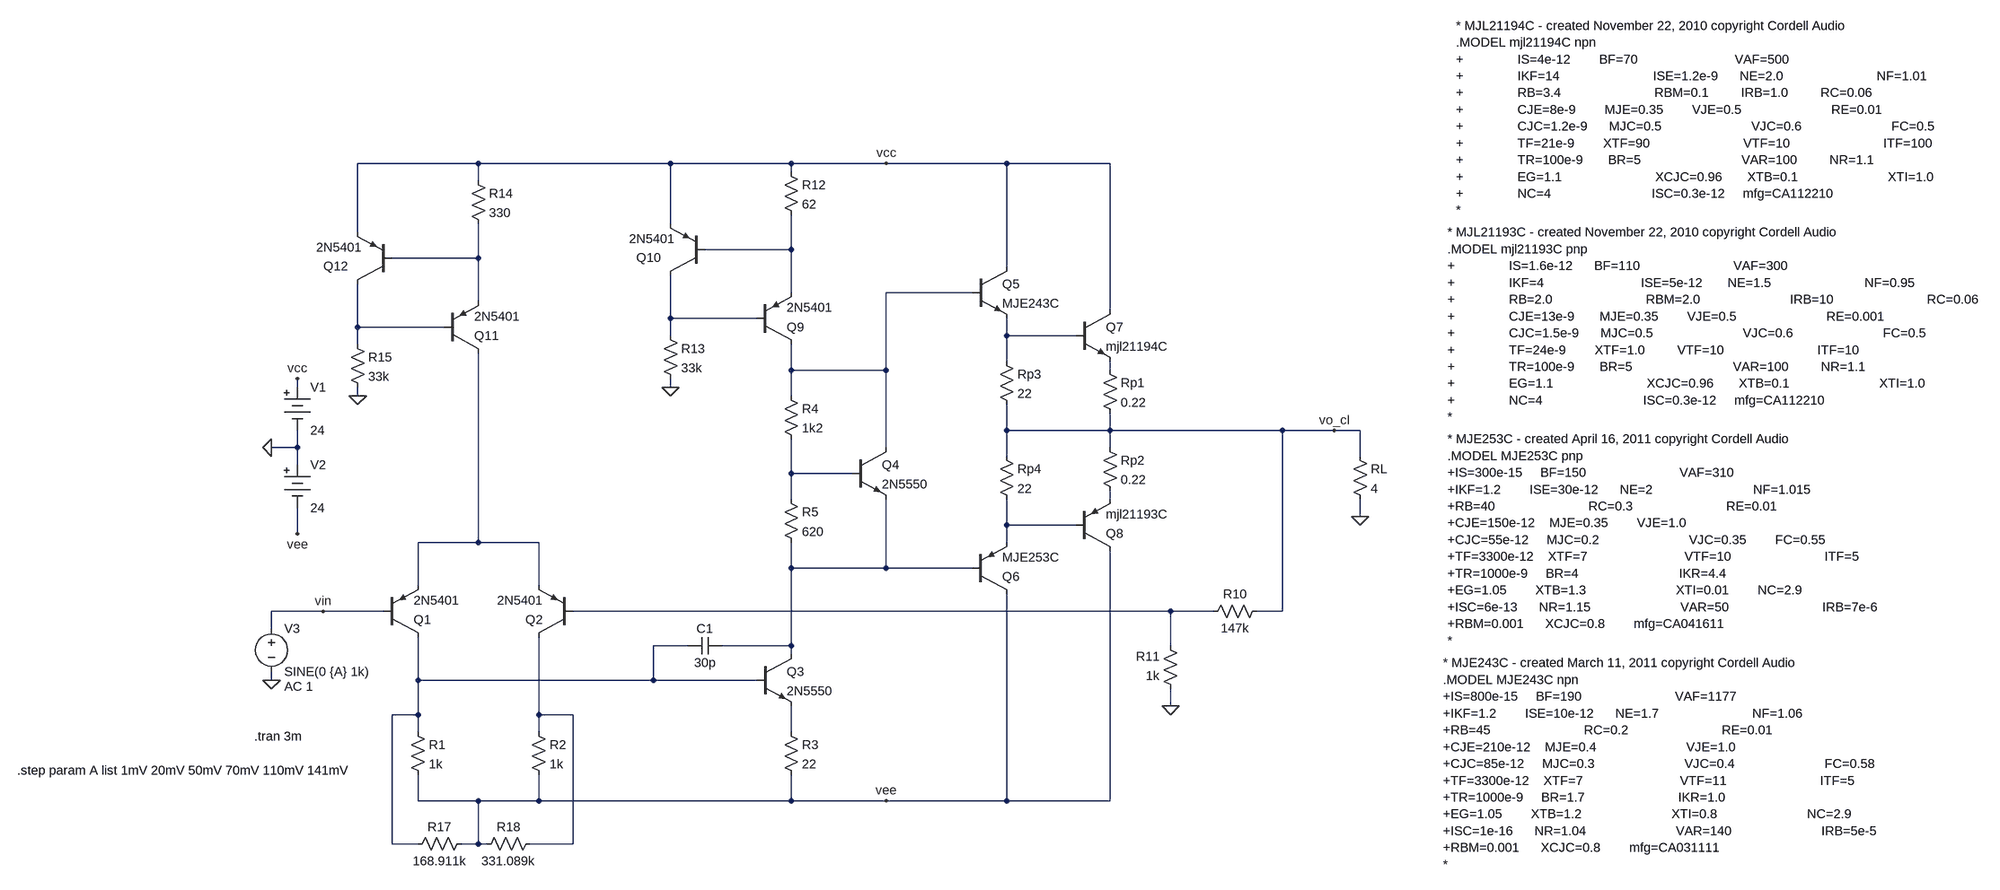
[diagram p0: schematic tpo.asc]
tpo.asc, the LTspice schematic file:
Version 4
SHEET 1 4744 984
WIRE 592 -496 368 -496
WIRE 992 -496 592 -496
WIRE 1216 -496 992 -496
WIRE 1392 -496 1216 -496
WIRE 1616 -496 1392 -496
WIRE 1808 -496 1616 -496
WIRE 1216 -480 1216 -496
WIRE 592 -464 592 -496
WIRE 992 -384 992 -496
WIRE 368 -368 368 -496
WIRE 1216 -336 1216 -400
WIRE 1216 -336 1056 -336
WIRE 592 -320 592 -384
WIRE 592 -320 432 -320
WIRE 1616 -304 1616 -496
WIRE 1216 -256 1216 -336
WIRE 1552 -256 1392 -256
WIRE 592 -240 592 -320
WIRE 1808 -224 1808 -496
WIRE 992 -208 992 -288
WIRE 1152 -208 992 -208
WIRE 368 -192 368 -272
WIRE 528 -192 368 -192
WIRE 992 -176 992 -208
WIRE 1616 -176 1616 -208
WIRE 1744 -176 1616 -176
WIRE 368 -160 368 -192
WIRE 1616 -128 1616 -176
WIRE 1216 -112 1216 -160
WIRE 1392 -112 1392 -256
WIRE 1392 -112 1216 -112
WIRE 1808 -112 1808 -128
WIRE 256 -80 256 -96
WIRE 992 -80 992 -96
WIRE 368 -64 368 -80
WIRE 1216 -64 1216 -112
WIRE 1616 0 1616 -48
WIRE 1808 0 1808 -32
WIRE 1808 0 1616 0
WIRE 2128 0 1808 0
WIRE 2224 0 2128 0
WIRE 2272 0 2224 0
WIRE 256 32 256 0
WIRE 256 32 208 32
WIRE 1392 32 1392 -112
WIRE 1808 32 1808 0
WIRE 1616 48 1616 0
WIRE 2272 48 2272 0
WIRE 256 64 256 32
WIRE 1216 80 1216 16
WIRE 1328 80 1216 80
WIRE 1216 128 1216 80
WIRE 1808 128 1808 112
WIRE 2272 160 2272 128
WIRE 1616 176 1616 128
WIRE 1744 176 1616 176
WIRE 256 192 256 144
WIRE 592 208 592 -144
WIRE 592 208 480 208
WIRE 704 208 592 208
WIRE 1616 208 1616 176
WIRE 1216 256 1216 208
WIRE 1392 256 1392 128
WIRE 1392 256 1216 256
WIRE 1552 256 1392 256
WIRE 480 288 480 208
WIRE 704 288 704 208
WIRE 304 336 208 336
WIRE 416 336 304 336
WIRE 1920 336 768 336
WIRE 2000 336 1920 336
WIRE 2128 336 2128 0
WIRE 2128 336 2080 336
WIRE 208 368 208 336
WIRE 1024 400 960 400
WIRE 1216 400 1216 256
WIRE 1216 400 1088 400
WIRE 1920 400 1920 336
WIRE 1216 416 1216 400
WIRE 208 464 208 448
WIRE 480 464 480 384
WIRE 960 464 960 400
WIRE 960 464 480 464
WIRE 1152 464 960 464
WIRE 1920 512 1920 480
WIRE 480 528 480 464
WIRE 480 528 432 528
WIRE 704 528 704 384
WIRE 768 528 704 528
WIRE 480 560 480 528
WIRE 704 560 704 528
WIRE 1216 560 1216 512
WIRE 480 688 480 640
WIRE 592 688 480 688
WIRE 704 688 704 640
WIRE 704 688 592 688
WIRE 1216 688 1216 640
WIRE 1216 688 704 688
WIRE 1392 688 1216 688
WIRE 1616 688 1616 304
WIRE 1616 688 1392 688
WIRE 1808 688 1808 224
WIRE 1808 688 1616 688
WIRE 432 768 432 528
WIRE 480 768 432 768
WIRE 592 768 592 688
WIRE 592 768 560 768
WIRE 608 768 592 768
WIRE 768 768 768 528
WIRE 768 768 688 768
FLAG 208 32 0
FLAG 256 -96 vcc
FLAG 1392 -496 vcc
FLAG 256 192 vee
FLAG 1392 688 vee
FLAG 208 464 0
FLAG 2272 160 0
FLAG 992 -80 0
FLAG 1920 512 0
FLAG 368 -64 0
FLAG 2224 0 vo_cl
FLAG 304 336 vin
SYMBOL voltage 208 352 R0
WINDOW 123 24 124 Left 2
WINDOW 39 0 0 Left 2
SYMATTR Value2 AC 1
SYMATTR InstName V3
SYMATTR Value SINE(0 {A} 1k)
SYMBOL npn 1152 416 R0
SYMATTR InstName Q3
SYMATTR Value 2N5550
SYMBOL res 1200 -80 R0
SYMATTR InstName R4
SYMATTR Value 1k2
SYMBOL res 1200 112 R0
SYMATTR InstName R5
SYMATTR Value 620
SYMBOL res 2256 32 R0
SYMATTR InstName RL
SYMATTR Value 4
SYMBOL res 464 544 R0
SYMATTR InstName R1
SYMATTR Value 1k
SYMBOL pnp 416 384 M180
SYMATTR InstName Q1
SYMATTR Value 2N5401
SYMBOL pnp 768 384 R180
SYMATTR InstName Q2
SYMATTR Value 2N5401
SYMBOL npn 1328 32 R0
SYMATTR InstName Q4
SYMATTR Value 2N5550
SYMBOL res 1200 544 R0
SYMATTR InstName R3
SYMATTR Value 22
SYMBOL pnp 1152 -160 M180
SYMATTR InstName Q9
SYMATTR Value 2N5401
SYMBOL pnp 1056 -288 R180
WINDOW 0 82 33 Left 2
SYMATTR InstName Q10
SYMATTR Value 2N5401
SYMBOL res 1200 -496 R0
SYMATTR InstName R12
SYMATTR Value 62
SYMBOL res 976 -192 R0
SYMATTR InstName R13
SYMATTR Value 33k
SYMBOL res 2096 320 R90
WINDOW 0 0 56 VBottom 2
WINDOW 3 32 56 VTop 2
SYMATTR InstName R10
SYMATTR Value 147k
SYMBOL res 1936 496 R180
WINDOW 0 36 76 Left 2
WINDOW 3 36 40 Left 2
SYMATTR InstName R11
SYMATTR Value 1k
SYMBOL cap 1088 384 R90
WINDOW 0 0 32 VBottom 2
WINDOW 3 32 32 VTop 2
SYMATTR InstName C1
SYMATTR Value 30p
SYMBOL npn 1552 -304 R0
SYMATTR InstName Q5
SYMATTR Value MJE243C
SYMBOL npn 1744 -224 R0
SYMATTR InstName Q7
SYMATTR Value mjl21194C
SYMBOL pnp 1552 304 M180
SYMATTR InstName Q6
SYMATTR Value MJE253C
SYMBOL pnp 1744 224 M180
SYMATTR InstName Q8
SYMATTR Value mjl21193C
SYMBOL res 1600 -144 R0
SYMATTR InstName Rp3
SYMATTR Value 22
SYMBOL res 1600 32 R0
SYMATTR InstName Rp4
SYMATTR Value 22
SYMBOL res 1792 -128 R0
SYMATTR InstName Rp1
SYMATTR Value 0.22
SYMBOL res 1792 16 R0
SYMATTR InstName Rp2
SYMATTR Value 0.22
SYMBOL res 688 544 R0
SYMATTR InstName R2
SYMATTR Value 1k
SYMBOL pnp 528 -144 M180
SYMATTR InstName Q11
SYMATTR Value 2N5401
SYMBOL pnp 432 -272 R180
WINDOW 0 82 33 Left 2
SYMATTR InstName Q12
SYMATTR Value 2N5401
SYMBOL res 576 -480 R0
SYMATTR InstName R14
SYMATTR Value 330
SYMBOL res 352 -176 R0
SYMATTR InstName R15
SYMATTR Value 33k
SYMBOL res 576 752 R90
WINDOW 0 0 56 VBottom 2
WINDOW 3 32 56 VTop 2
SYMATTR InstName R17
SYMATTR Value 168.911k
SYMBOL res 704 752 R90
WINDOW 0 0 56 VBottom 2
WINDOW 3 32 56 VTop 2
SYMATTR InstName R18
SYMATTR Value 331.089k
SYMBOL Misc\\battery 256 -96 R0
WINDOW 123 0 0 Left 0
WINDOW 39 0 0 Left 0
SYMATTR InstName V1
SYMATTR Value 24
SYMBOL Misc\\battery 256 48 R0
WINDOW 123 0 0 Left 0
WINDOW 39 0 0 Left 0
SYMATTR InstName V2
SYMATTR Value 24
TEXT 176 568 Left 2 !.tran 3m
TEXT 3360 -752 Left 2 !* MJL21194C - created November 22, 2010 copyright Cordell Audio\n.MODEL mjl21194C npn\n+               IS=4e-12        BF=70                           VAF=500         \n+               IKF=14                          ISE=1.2e-9      NE=2.0                          NF=1.01\n+               RB=3.4                          RBM=0.1         IRB=1.0         RC=0.06\n+               CJE=8e-9        MJE=0.35        VJE=0.5                         RE=0.01\n+               CJC=1.2e-9      MJC=0.5                         VJC=0.6                         FC=0.5\n+               TF=21e-9        XTF=90                          VTF=10                          ITF=100\n+               TR=100e-9       BR=5                            VAR=100         NR=1.1\n+               EG=1.1                          XCJC=0.96       XTB=0.1                         XTI=1.0         \n+               NC=4                            ISC=0.3e-12     mfg=CA112210 \n*
TEXT 3344 -368 Left 2 !* MJL21193C - created November 22, 2010 copyright Cordell Audio\n.MODEL mjl21193C pnp\n+               IS=1.6e-12      BF=110                          VAF=300         \n+               IKF=4                           ISE=5e-12       NE=1.5                          NF=0.95\n+               RB=2.0                          RBM=2.0                         IRB=10                          RC=0.06\n+               CJE=13e-9       MJE=0.35        VJE=0.5                         RE=0.001\n+               CJC=1.5e-9      MJC=0.5                         VJC=0.6                         FC=0.5\n+               TF=24e-9        XTF=1.0         VTF=10                          ITF=10\n+               TR=100e-9       BR=5                            VAR=100         NR=1.1\n+               EG=1.1                          XCJC=0.96       XTB=0.1                         XTI=1.0         \n+               NC=4                            ISC=0.3e-12     mfg=CA112210 \n*
TEXT 3344 16 Left 2 !* MJE253C - created April 16, 2011 copyright Cordell Audio\n.MODEL MJE253C pnp\n+IS=300e-15     BF=150                          VAF=310\n+IKF=1.2        ISE=30e-12      NE=2                            NF=1.015\n+RB=40                          RC=0.3                          RE=0.01\n+CJE=150e-12    MJE=0.35        VJE=1.0\n+CJC=55e-12     MJC=0.2                         VJC=0.35        FC=0.55\n+TF=3300e-12    XTF=7                           VTF=10                          ITF=5\n+TR=1000e-9     BR=4                            IKR=4.4\n+EG=1.05        XTB=1.3                         XTI=0.01        NC=2.9\n+ISC=6e-13      NR=1.15                         VAR=50                          IRB=7e-6\n+RBM=0.001      XCJC=0.8        mfg=CA041611\n*
TEXT 3336 432 Left 2 !* MJE243C - created March 11, 2011 copyright Cordell Audio\n.MODEL MJE243C npn\n+IS=800e-15     BF=190                          VAF=1177\n+IKF=1.2        ISE=10e-12      NE=1.7                          NF=1.06\n+RB=45                          RC=0.2                          RE=0.01\n+CJE=210e-12    MJE=0.4                         VJE=1.0\n+CJC=85e-12     MJC=0.3                         VJC=0.4                         FC=0.58\n+TF=3300e-12    XTF=7                           VTF=11                          ITF=5\n+TR=1000e-9     BR=1.7                          IKR=1.0\n+EG=1.05        XTB=1.2                         XTI=0.8                         NC=2.9\n+ISC=1e-16      NR=1.04                         VAR=140                         IRB=5e-5\n+RBM=0.001      XCJC=0.8        mfg=CA031111\n*
TEXT -264 632 Left 2 !.step param A list 1mV 20mV 50mV 70mV 110mV 141mV

The netlist it stands for:
* tpo.asc
V3 vin 0 SINE(0 {A} 1k) AC 1
Q3 N012 N014 N016 0 2N5550
R4 N003 N008 1k2
R5 N008 N012 620
RL vo_cl 0 4
R1 N014 vee 1k
Q1 N014 vin N011 0 2N5401
Q2 N015 N013 N011 0 2N5401
Q4 N003 N008 N012 0 2N5550
R3 N016 vee 22
Q9 N003 N004 N001 0 2N5401
Q10 N004 N001 vcc 0 2N5401
R12 vcc N001 62
R13 N004 0 33k
R10 vo_cl N013 147k
R11 0 N013 1k
C1 N012 N014 30p
Q5 vcc N003 N006 0 MJE243C
Q7 vcc N006 N007 0 mjl21194C
Q6 vee N012 N010 0 MJE253C
Q8 vee N010 N009 0 mjl21193C
Rp3 N006 vo_cl 22
Rp4 vo_cl N010 22
Rp1 N007 vo_cl 0.22
Rp2 vo_cl N009 0.22
R2 N015 vee 1k
Q11 N011 N005 N002 0 2N5401
Q12 N005 N002 vcc 0 2N5401
R14 vcc N002 330
R15 N005 0 33k
R17 vee N014 168.911k
R18 N015 vee 331.089k
V1 vcc 0 24
V2 0 vee 24
.model NPN NPN
.model PNP PNP
.lib standard.bjt
.tran 3m
* MJL21194C - created November 22, 2010 copyright Cordell Audio
.MODEL mjl21194C npn
+               IS=4e-12        BF=70                           VAF=500
+               IKF=14                          ISE=1.2e-9      NE=2.0                          NF=1.01
+               RB=3.4                          RBM=0.1         IRB=1.0         RC=0.06
+               CJE=8e-9        MJE=0.35        VJE=0.5                         RE=0.01
+               CJC=1.2e-9      MJC=0.5                         VJC=0.6                         FC=0.5
+               TF=21e-9        XTF=90                          VTF=10                          ITF=100
+               TR=100e-9       BR=5                            VAR=100         NR=1.1
+               EG=1.1                          XCJC=0.96       XTB=0.1                         XTI=1.0
+               NC=4                            ISC=0.3e-12     mfg=CA112210
*
* MJL21193C - created November 22, 2010 copyright Cordell Audio
.MODEL mjl21193C pnp
+               IS=1.6e-12      BF=110                          VAF=300
+               IKF=4                           ISE=5e-12       NE=1.5                          NF=0.95
+               RB=2.0                          RBM=2.0                         IRB=10                          RC=0.06
+               CJE=13e-9       MJE=0.35        VJE=0.5                         RE=0.001
+               CJC=1.5e-9      MJC=0.5                         VJC=0.6                         FC=0.5
+               TF=24e-9        XTF=1.0         VTF=10                          ITF=10
+               TR=100e-9       BR=5                            VAR=100         NR=1.1
+               EG=1.1                          XCJC=0.96       XTB=0.1                         XTI=1.0
+               NC=4                            ISC=0.3e-12     mfg=CA112210
*
* MJE253C - created April 16, 2011 copyright Cordell Audio
.MODEL MJE253C pnp
+IS=300e-15     BF=150                          VAF=310
+IKF=1.2        ISE=30e-12      NE=2                            NF=1.015
+RB=40                          RC=0.3                          RE=0.01
+CJE=150e-12    MJE=0.35        VJE=1.0
+CJC=55e-12     MJC=0.2                         VJC=0.35        FC=0.55
+TF=3300e-12    XTF=7                           VTF=10                          ITF=5
+TR=1000e-9     BR=4                            IKR=4.4
+EG=1.05        XTB=1.3                         XTI=0.01        NC=2.9
+ISC=6e-13      NR=1.15                         VAR=50                          IRB=7e-6
+RBM=0.001      XCJC=0.8        mfg=CA041611
*
* MJE243C - created March 11, 2011 copyright Cordell Audio
.MODEL MJE243C npn
+IS=800e-15     BF=190                          VAF=1177
+IKF=1.2        ISE=10e-12      NE=1.7                          NF=1.06
+RB=45                          RC=0.2                          RE=0.01
+CJE=210e-12    MJE=0.4                         VJE=1.0
+CJC=85e-12     MJC=0.3                         VJC=0.4                         FC=0.58
+TF=3300e-12    XTF=7                           VTF=11                          ITF=5
+TR=1000e-9     BR=1.7                          IKR=1.0
+EG=1.05        XTB=1.2                         XTI=0.8                         NC=2.9
+ISC=1e-16      NR=1.04                         VAR=140                         IRB=5e-5
+RBM=0.001      XCJC=0.8        mfg=CA031111
*
.step param A list 1mV 20mV 50mV 70mV 110mV 141mV
.backanno
.end